# EAGLE design Led_Bar (EAGLE 6.5.0)
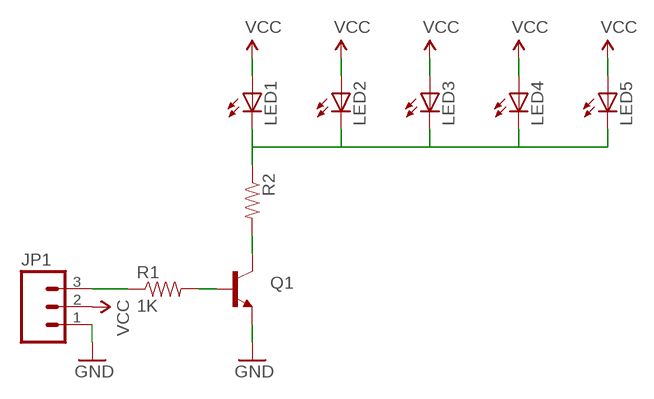
[diagram p0: schematic, sheet 1]

## Parts
JP1  M03PTH  [1X03]
LED1  LED5MM  [LED5MM]
LED2  LED5MM  [LED5MM]
LED3  LED5MM  [LED5MM]
LED4  LED5MM  [LED5MM]
LED5  LED5MM  [LED5MM]
Q1  TRANSISTOR_NPNTO-92-AMMO  [TO-92-AMMO]
R1  1K  RESISTORAXIAL-0.3  [AXIAL-0.3]
R2  RESISTORAXIAL-0.3  [AXIAL-0.3]

## Nets
GND: JP1.1 Q1.1(E)
N$1: Q1.2(B) R1.P$2
N$2: JP1.3 R1.P$1
N$3: Q1.3(C) R2.P$2
N$12: LED1.K(C) LED2.K(C) LED3.K(C) LED4.K(C) LED5.K(C) R2.P$1
VCC: JP1.2 LED1.A LED2.A LED3.A LED4.A LED5.A

## Library data of the parts
JP1 = SparkFun-Connectors:M03: Header 3 Standard 3-pin 0.1" header. Use with straight break away headers (SKU : PRT-00116), right angle break away headers (PRT-00553), swiss pins (PRT-00743), machine pins (PRT-00117), and female headers (PRT-00115). Molex polarized connector foot print use with SKU : PRT-08232 with associated crimp pins and housings.
LED1-LED5 = SparkFun-LED:LED: LEDs Standard schematic elements and footprints for 5mm, 3mm, 1206, and 0603 sized LEDs. 5mm - Spark Fun Electronics SKU : COM-00529 (and others)
Q1 = barbary_enterprises:TRANSISTOR_NPN: Generic NPN BJT MMBT2222A - TRANS-08049 (SOT-23, 1A 40V) MPSA42 - TRANS-09116 (SOT-23, 500mA 300V) MMBT5088LT1G - TRANS-11160 (SOT-23, 50 mA 30V)
R1 R2 = SparkFun-Resistors:RESISTOR: Resistor Basic schematic elements and footprints for 0603, 1206, and PTH resistors.

## Board
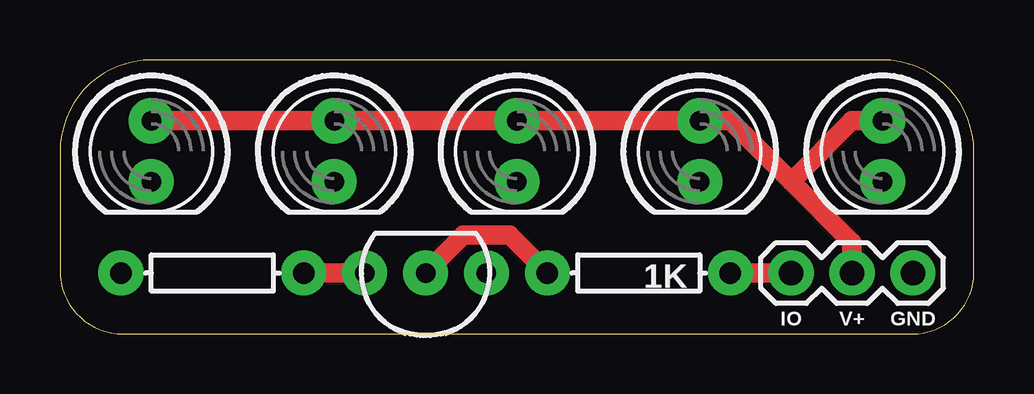
[diagram p1: board, top side]
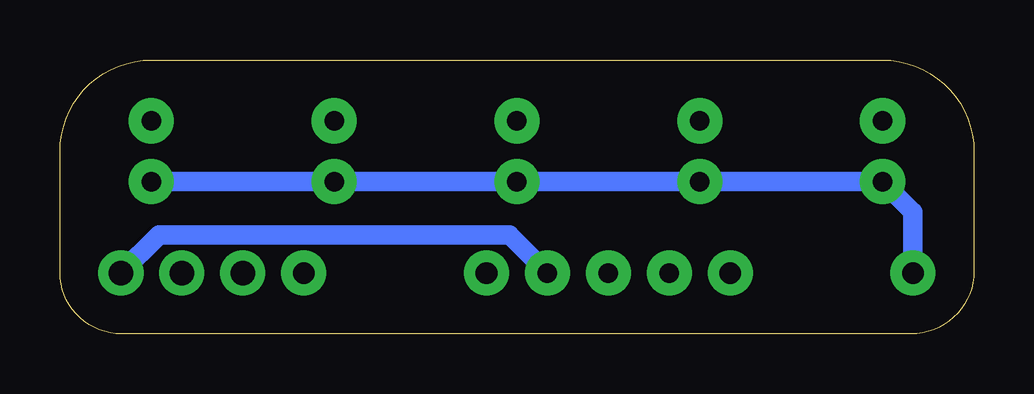
[diagram p2: board, bottom side, seen from below]

Size 38.1 x 11.43 mm. Coordinates in mm from the lower left corner, seen from the top.
Outline: 0,7.61 0,2.62 arc90 2.62,0 35.54,0 arc90 38.1,2.56 38.1,7.61 arc90 34.28,11.43 3.82,11.43 arc90 0,7.61
Copper layers (1*16): Top 0.035mm / dielectric 1.5mm / Bottom 0.035mm
Design rules "default": minimum track width 10mil, minimum drill 24mil, track to track 8mil, track to pad 8mil, pad to pad 8mil, via to via 8mil, smd to smd 8mil, copper to edge 40mil, drill to drill 8mil, minimum pad ring 10mil, minimum via ring 8mil, stop-mask expansion 4mil, vias tented up to drill 0mil, thermal gap 10mil

### Footprints (pad centres in the part's own frame; a part is rotated, then mirrored left to right if it is on the bottom)
1X03 = drill 1.016 pad 1.88: 1 0,0; 2 2.54,0; 3 5.08,0
LED5MM = drill 0.813 pad 1.88: A -1.27,0; K 1.27,0
TO-92-AMMO = drill 0.813 pad 1.88: 1 -2.54,0; 2 0,0; 3 2.54,0
AXIAL-0.3 = drill 0.9 pad 1.88: P$1 -3.81,0; P$2 3.81,0

### Placement (x,y rotation side)
JP1  35.56,2.54 180 top
LED1  3.81,7.62 270 top
LED2  11.43,7.62 270 top
LED3  19.05,7.62 270 top
LED4  26.67,7.62 270 top
LED5  34.29,7.62 270 top
Q1  15.24,2.54 180 top
R1  24.13,2.54 180 top
R2  6.35,2.54 0 top

### Tracks (layer width: path | path; a pad name or v marks a point on that pad's centre or on a via)
GND
  Bottom 0.813: Q1.1 19.37,4.13 33.97,4.13 JP1.1
N$1
  Top 0.813: Q1.2 16.83,4.13 18.73,4.13 R1.P$2
N$2
  Top 0.813: R1.P$1 JP1.3
N$3
  Top 0.813: R2.P$2 Q1.3
N$12
  Bottom 0.813: R2.P$1 2.54,5.08 LED1.K LED2.K LED3.K LED4.K LED5.K
VCC
  Top 0.813: JP1.2 33.02,3.81 30.48,6.35 | 30.48,6.35 27.94,8.89 LED4.A LED3.A LED2.A LED1.A | LED5.A 33.02,8.89 30.48,6.35

### Text on the board
tPlace: IO | V+ | GND